# Altium schematic sheet A dashBoard- VT01.SchDoc: 2521
size A4; CompanyName: Tarfand Co.; Engineer: P.Mansournia; Revision: 1
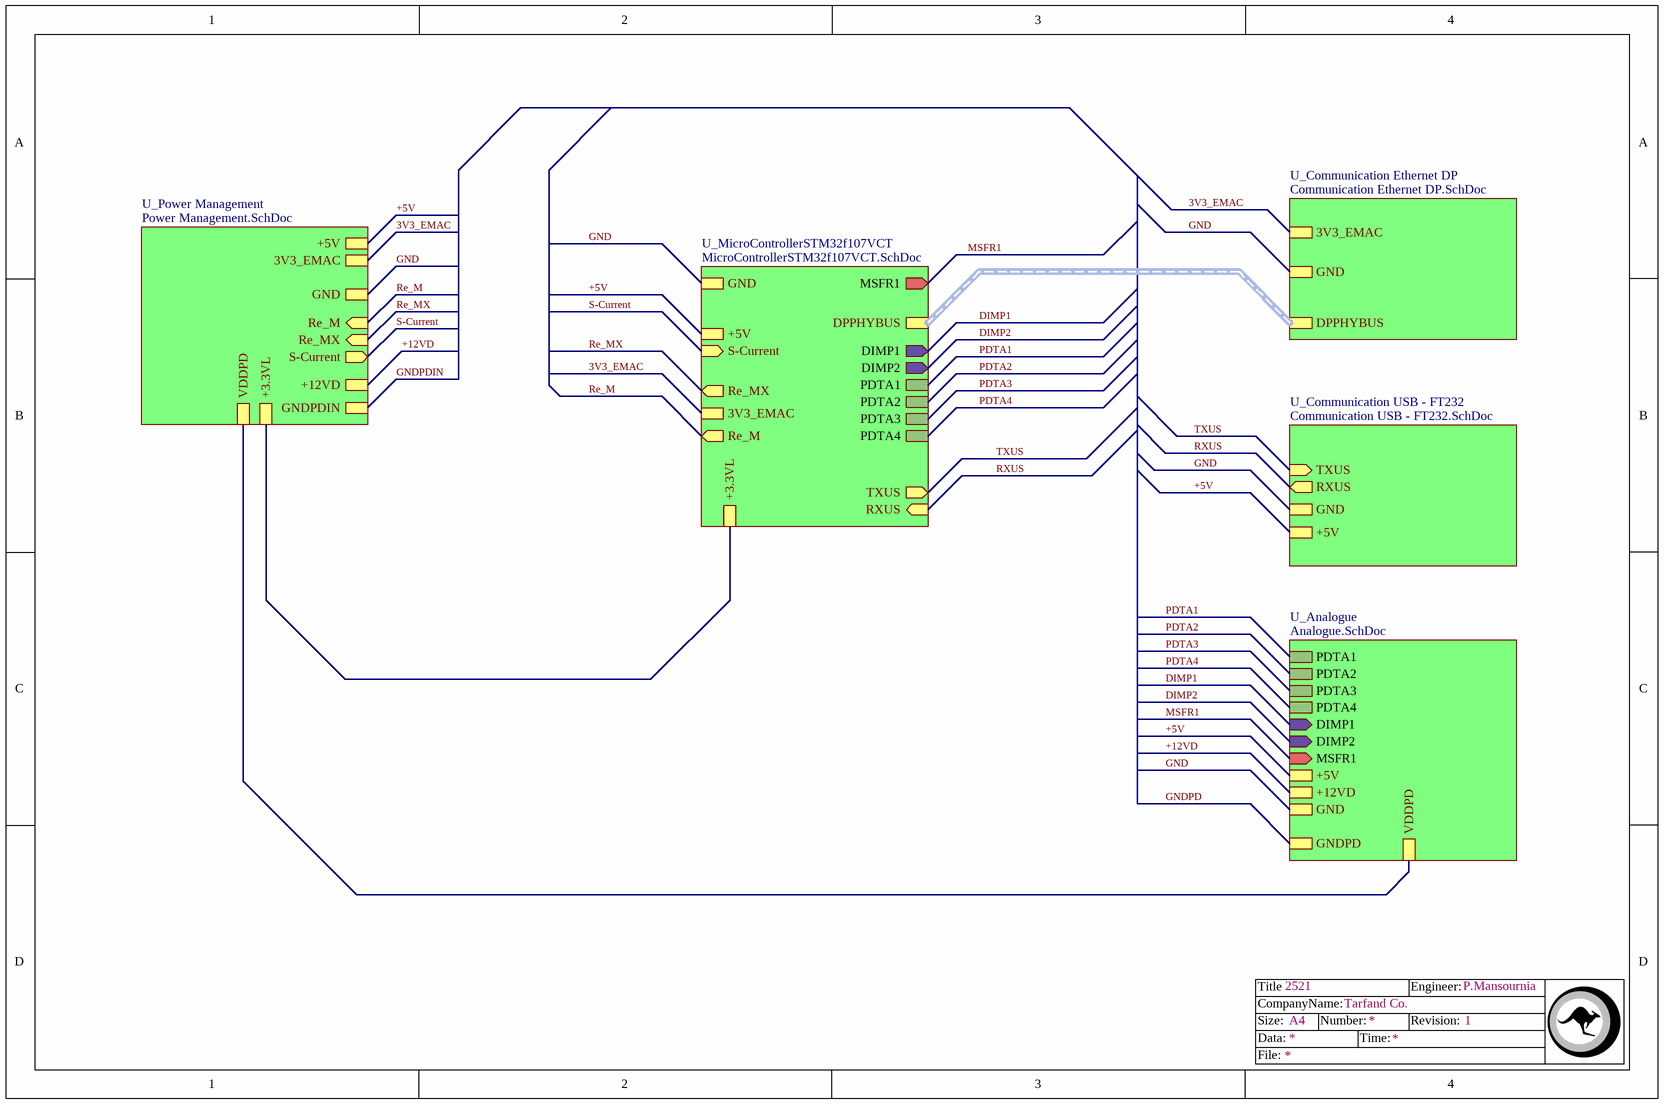
[diagram p0: A dashBoard- VT01.SchDoc]

## Sub-sheets
U_Analogue = Analogue.SchDoc: PDTA1, DIMP1 (in), PDTA3, PDTA2, PDTA4, DIMP2 (in), MSFR1 (in), +5V, +12VD, GND, VDDPD, GNDPD
U_Communication Ethernet DP = Communication Ethernet DP.SchDoc: 3V3_EMAC, GND, DPPHYBUS (harness DPPHYBUS)
U_Communication USB - FT232 = Communication USB - FT232.SchDoc: TXUS (in), RXUS (out), GND, +5V
U_MicroControllerSTM32f107VCT = MicroControllerSTM32f107VCT.SchDoc: GND, +3.3VL, DPPHYBUS (harness DPPHYBUS), DIMP1 (out), DIMP2 (out), PDTA1, PDTA2, PDTA3, PDTA4, S-Current (in), MSFR1 (out), +5V, RXUS (in), TXUS (out), Re_MX (out), 3V3_EMAC, Re_M (out)
U_Power Management = Power Management.SchDoc: 3V3_EMAC, S-Current (out), +3.3VL, Re_M (in), Re_MX (in), +5V, VDDPD, GNDPDIN, GND, +12VD

## Nets
3V3_EMAC: sheet U_Power Management/3V3_EMAC, sheet U_MicroControllerSTM32f107VCT/3V3_EMAC, sheet U_Communication Ethernet DP/3V3_EMAC
+5V: sheet U_Analogue/+5V, sheet U_Power Management/+5V, sheet U_MicroControllerSTM32f107VCT/+5V, sheet U_Communication USB - FT232/+5V
+12VD: sheet U_Analogue/+12VD, sheet U_Power Management/+12VD
DIMP1: sheet U_Analogue/DIMP1, sheet U_MicroControllerSTM32f107VCT/DIMP1
DIMP2: sheet U_Analogue/DIMP2, sheet U_MicroControllerSTM32f107VCT/DIMP2
GND: sheet U_Analogue/GND, sheet U_Power Management/GND, sheet U_MicroControllerSTM32f107VCT/GND, sheet U_Communication Ethernet DP/GND, sheet U_Communication USB - FT232/GND
GNDPD: sheet U_Analogue/GNDPD
GNDPDIN: sheet U_Power Management/GNDPDIN
MSFR1: sheet U_Analogue/MSFR1, sheet U_MicroControllerSTM32f107VCT/MSFR1
PDTA1: sheet U_Analogue/PDTA1, sheet U_MicroControllerSTM32f107VCT/PDTA1
PDTA2: sheet U_Analogue/PDTA2, sheet U_MicroControllerSTM32f107VCT/PDTA2
PDTA3: sheet U_Analogue/PDTA3, sheet U_MicroControllerSTM32f107VCT/PDTA3
PDTA4: sheet U_Analogue/PDTA4, sheet U_MicroControllerSTM32f107VCT/PDTA4
Re_M: sheet U_Power Management/Re_M, sheet U_MicroControllerSTM32f107VCT/Re_M
Re_MX: sheet U_Power Management/Re_MX, sheet U_MicroControllerSTM32f107VCT/Re_MX
RXUS: sheet U_MicroControllerSTM32f107VCT/RXUS, sheet U_Communication USB - FT232/RXUS
S-Current: sheet U_Power Management/S-Current, sheet U_MicroControllerSTM32f107VCT/S-Current
TXUS: sheet U_MicroControllerSTM32f107VCT/TXUS, sheet U_Communication USB - FT232/TXUS
(unnamed): sheet U_Analogue/VDDPD, sheet U_Power Management/VDDPD
(unnamed): sheet U_Power Management/+3.3VL, sheet U_MicroControllerSTM32f107VCT/+3.3VL

## Buses and harness runs
harness sheet U_Communication Ethernet DP/DPPHYBUS = sheet U_MicroControllerSTM32f107VCT/DPPHYBUS

## Notes on the sheet
- Title
- Size:
- Data:
- CompanyName:
- A4
- Number:
- Time:
- Revision:
- Engineer:
- File: